# EAGLE schematic reveng-cpuonly-smdsock (EAGLE 6.4)
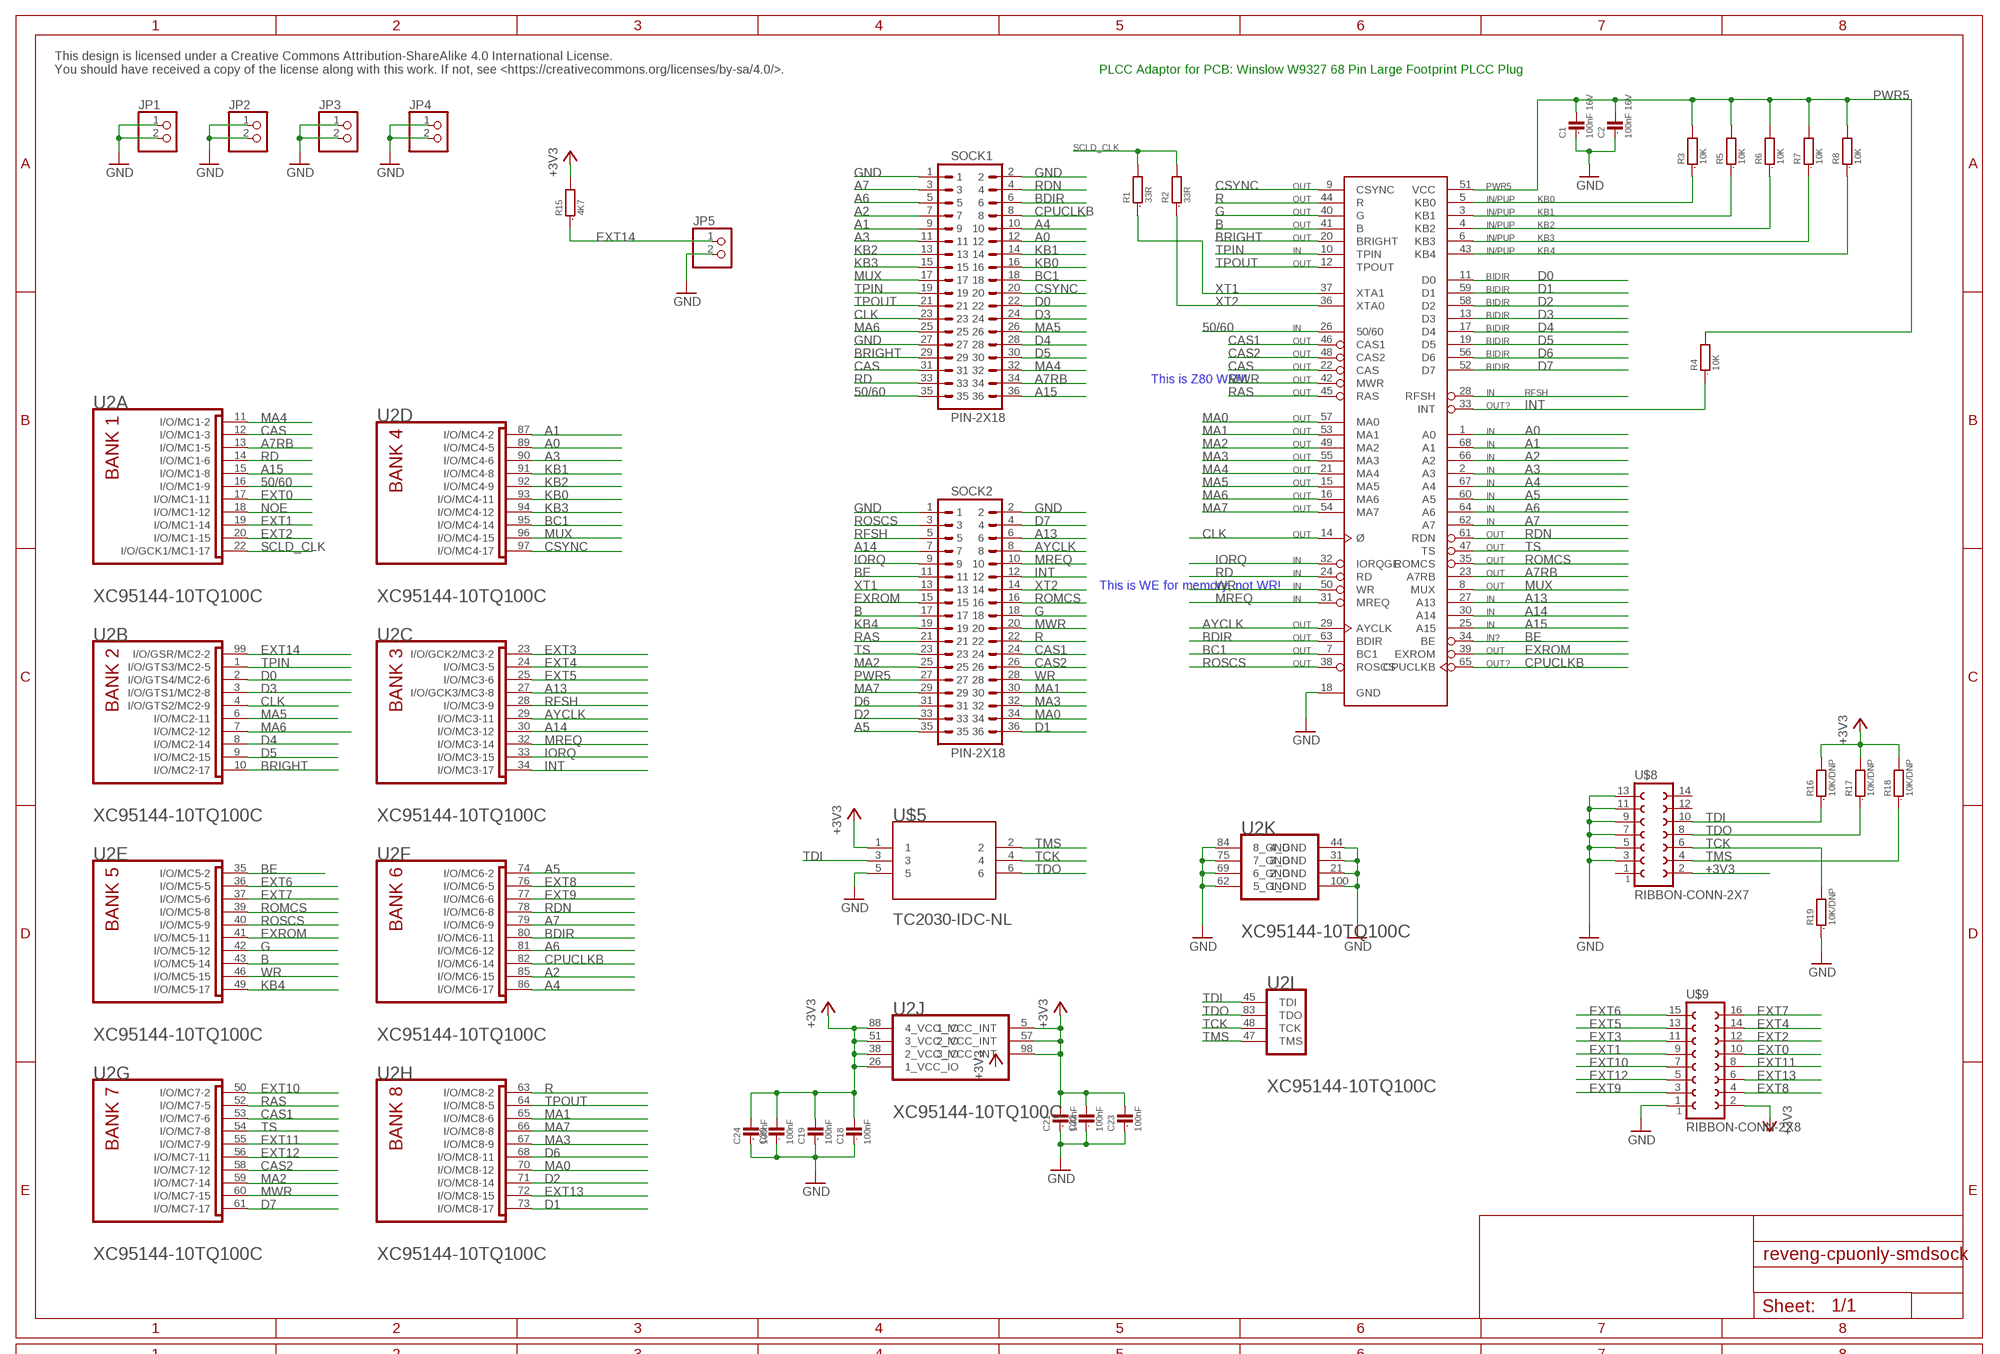
[diagram p0: schematic, sheet 1, part 1 of 2]
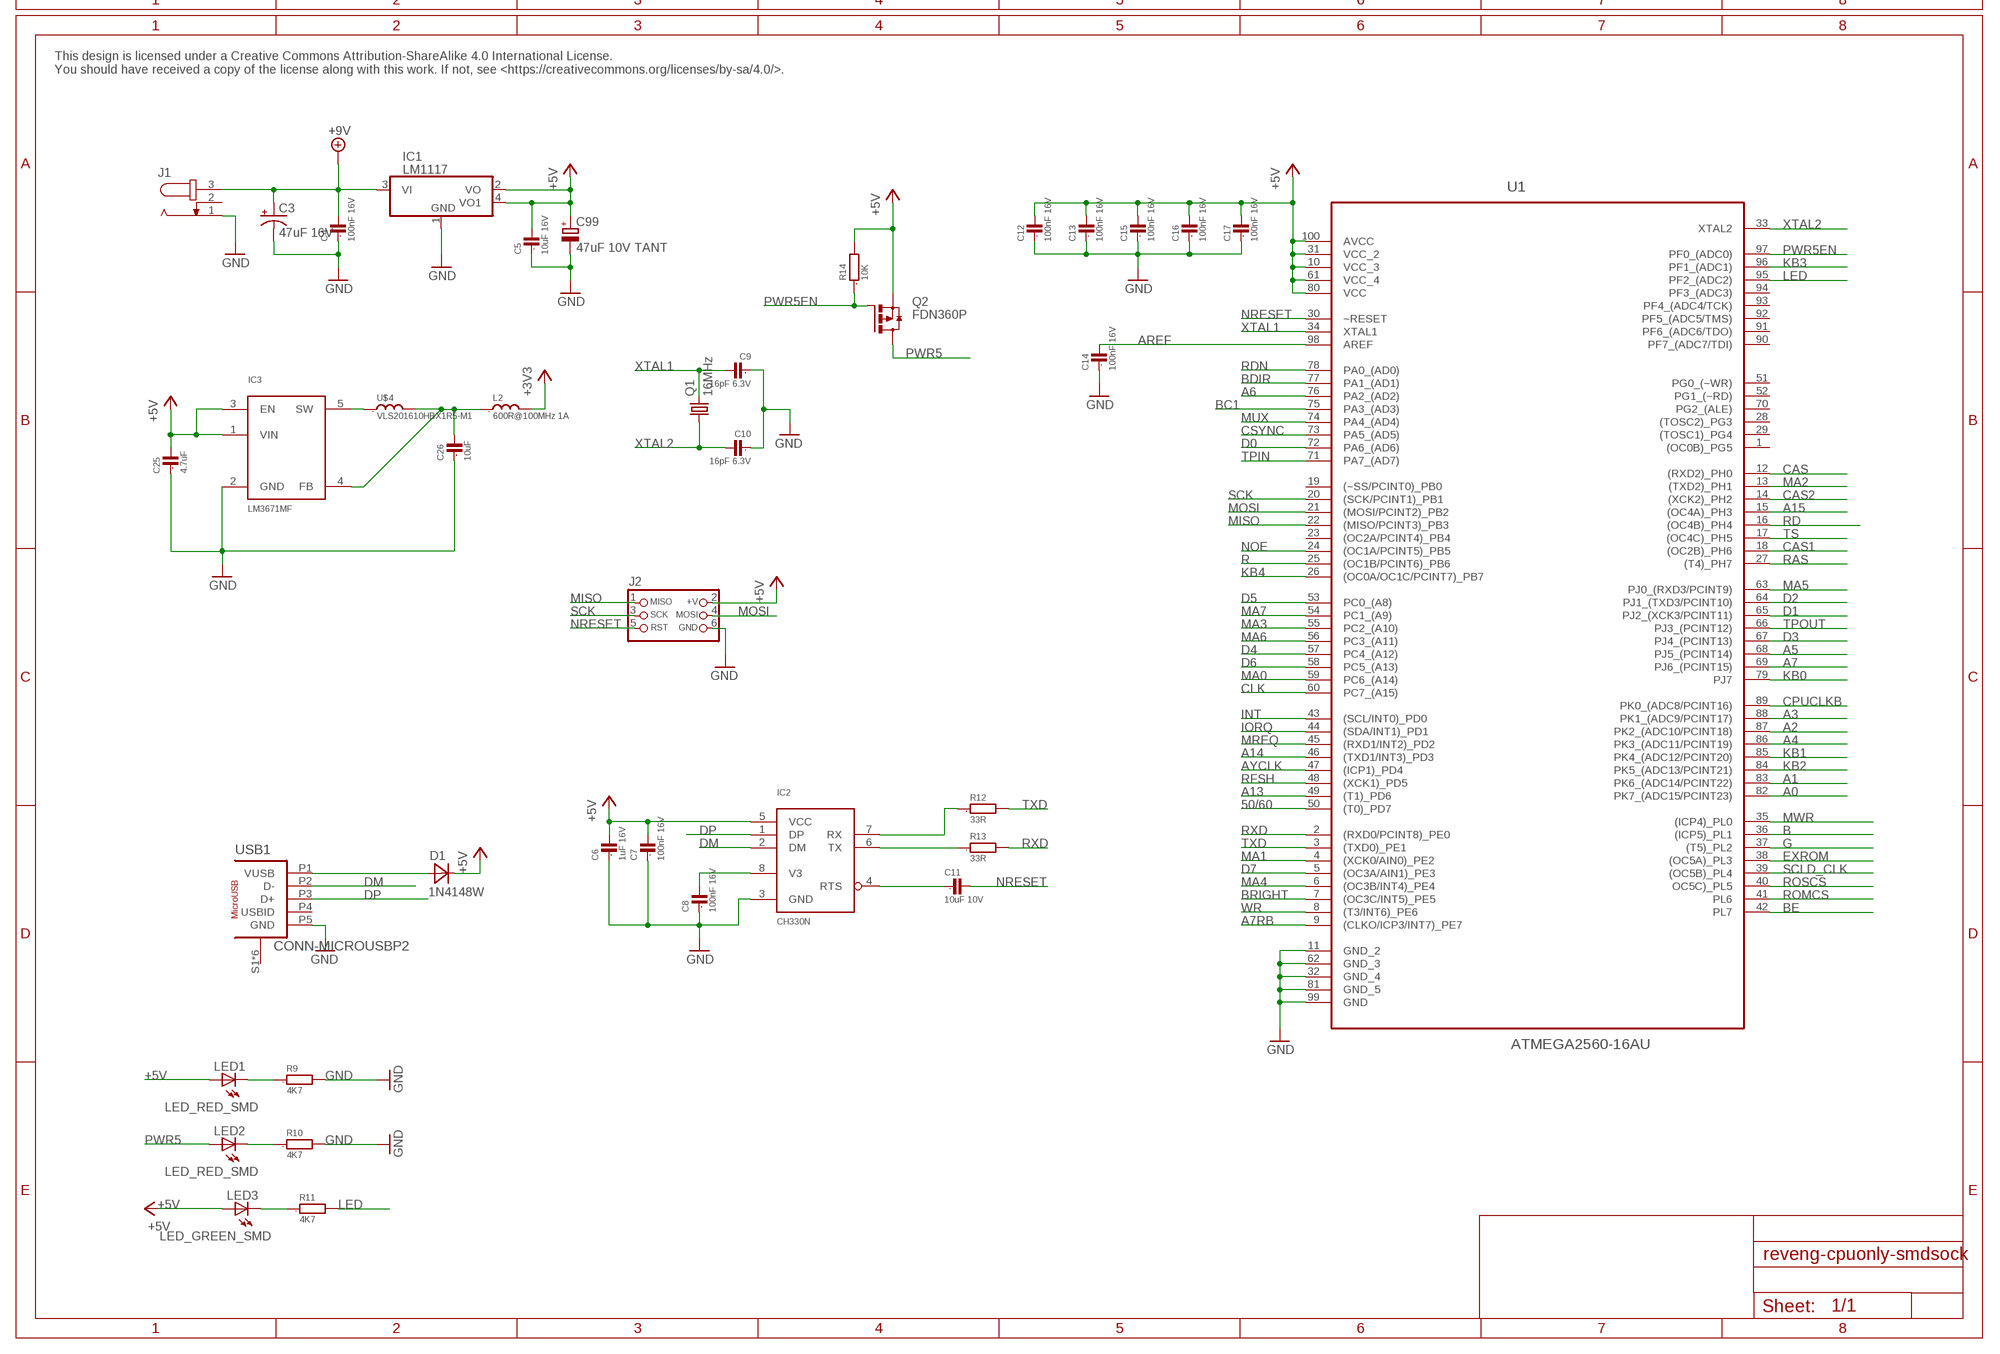
[diagram p1: schematic, sheet 1, part 2 of 2]

## Parts
C1  100nF 16V  C0603  [0603]
C2  100nF 16V  C0603  [0603]
C3  47uF 16V  CPOL-USE2.5-6  [E2,5-6]
C4  100nF 16V  C0603  [0603]
C5  10uF 16V  C0805  [0805]
C6  1uF 16V  C0603  [0603]
C7  100nF 16V  C0603  [0603]
C8  100nF 16V  C0603  [0603]
C9  16pF 6.3V  C0603  [0603]
C10  16pF 6.3V  C0603  [0603]
C11  10uF 10V  C0603  [0603]
C12  100nF 16V  C0603  [0603]
C13  100nF 16V  C0603  [0603]
C14  100nF 16V  C0603  [0603]
C15  100nF 16V  C0603  [0603]
C16  100nF 16V  C0603  [0603]
C17  100nF 16V  C0603  [0603]
C18  100nF  C0603  [0603]
C19  100nF  C0603  [0603]
C20  100nF  C0603  [0603]
C21  100nF  C0603  [0603]
C22  100nF  C0603  [0603]
C23  100nF  C0603  [0603]
C24  100nF  C0603  [0603]
C25  4.7uF  C0805  [0805]
C26  10uF  C0805  [0805]
C99  47uF 10V TANT  TANT_CASE_A  [TANT_CASE_A]
D1  1N4148W  [SOD-123]
IC1  LM1117  [SOT223]
IC2  CH330N  [SOIC8]
IC3  LM3671MF  [SOT23-5L]
J1  JACK-PLUG  [SPC4078-NOSLOT]
J2  CON_HEADER_PRG_AVR_ICSP-PTH  [HEADER_PRG_2X03]
JP1  PINHD-1X2  [1X02]
JP2  PINHD-1X2  [1X02]
JP3  PINHD-1X2  [1X02]
JP4  PINHD-1X2  [1X02]
JP5  PINHD-1X2  [1X02]
L2  600R@100MHz 1A  L0805  [0805]
LED1  LED_RED_SMD  LED-0603  [LED-603]
LED2  LED_RED_SMD  LED-0603  [LED-603]
LED3  LED_GREEN_SMD  LED-0603  [LED-603]
Q1  16MHz  CRYSTALHC49U-V  [HC49U-V]
Q2  FDN360P  [SUPER-SOT3]
R1  33R  R0603  [0603]
R2  33R  R0603  [0603]
R3  10K  R0603  [0603]
R4  10K  R0603  [0603]
R5  10K  R0603  [0603]
R6  10K  R0603  [0603]
R7  10K  R0603  [0603]
R8  10K  R0603  [0603]
R9  4K7  R0603  [0603]
R10  4K7  R0603  [0603]
R11  4K7  R0603  [0603]
R12  33R  R0603  [0603]
R13  33R  R0603  [0603]
R14  10K  R0603  [0603]
R15  4K7  R0603  [0603]
R16  10K/DNP  R0603  [0603]
R17  10K/DNP  R0603  [0603]
R18  10K/DNP  R0603  [0603]
R19  10K/DNP  R0603  [0603]
SCLD1  2048SCLDSMDSOCK  [PLCC68-AMP-SOCKET]
SOCK1  PIN-2X18  [PIN-2X18]
SOCK2  PIN-2X18  [PIN-2X18]
U1  ATMEGA2560-16AU  [QFP50P1600X1600X120-100N]
U2  XILINX_XC95144-10TQ100CLQFP  [LQFP100]
U$4  VLS201610HBX1R5-M1  [IND_0806]
U$5  TC2030-IDC-NL  [TC2030-IDC-NL]
U$8  RIBBON-CONN-2X7  [RIBBON-CONN-2X7]
U$9  RIBBON-CONN-2X8  [RIBBON-CONN-2X8]
USB1  CONN-MICROUSBP2  [MICROUSB_SMD_TH_7.5MM_4.85MM]

## Nets
50/60: SCLD1.26(50/60) SOCK1.35 U1.50((T0)_PD7) U2.16(A:I/O/MC1-9)
+3V3: C18.2 C19.2 C20.2 C21.2 C22.2 C23.2 C24.2 L2.2 R15.2 R16.2 R17.2 R18.2 U2.5(J:1_VCC_INT) U2.26(J:1_VCC_IO) U2.38(J:2_VCC_IO) U2.51(J:3_VCC_IO) U2.57(J:2_VCC_INT) U2.88(J:4_VCC_IO) U2.98(J:3_VCC_INT) U$5.1 U$8.2 U$9.2
+5V: C5.2 C6.2 C7.2 C12.2 C13.2 C15.2 C16.2 C17.2 C25.2 C99.PLUS(+) D1.1(C) IC1.2(VO) IC1.4(VO1) IC2.5(VCC) IC3.1(VIN) IC3.3(EN) J2.2(+V) LED1.A LED3.A Q2.2(S) R14.2 U1.10(VCC_3) U1.31(VCC_2) U1.61(VCC_4) U1.80(VCC) U1.100(AVCC)
+9V: C3.+ C4.2 IC1.3(VI) J1.3
A0: SCLD1.1(A0) SOCK1.12 U1.82(PK7_(ADC15/PCINT23)) U2.89(D:I/O/MC4-5)
A1: SCLD1.68(A1) SOCK1.9 U1.83(PK6_(ADC14/PCINT22)) U2.87(D:I/O/MC4-2)
A2: SCLD1.66(A2) SOCK1.7 U1.87(PK2_(ADC10/PCINT18)) U2.85(F:I/O/MC6-15)
A3: SCLD1.2(A3) SOCK1.11 U1.88(PK1_(ADC9/PCINT17)) U2.90(D:I/O/MC4-6)
A4: SCLD1.67(A4) SOCK1.10 U1.86(PK3_(ADC11/PCINT19)) U2.86(F:I/O/MC6-17)
A5: SCLD1.60(A5) SOCK2.35 U1.68(PJ5_(PCINT14)) U2.74(F:I/O/MC6-2)
A6: SCLD1.64(A6) SOCK1.5 U1.76(PA2_(AD2)) U2.81(F:I/O/MC6-12)
A7: SCLD1.62(A7) SOCK1.3 U1.69(PJ6_(PCINT15)) U2.79(F:I/O/MC6-9)
A7RB: SCLD1.23(A7RB) SOCK1.34 U1.9((CLKO/ICP3/INT7)_PE7) U2.13(A:I/O/MC1-5)
A13: SCLD1.27(A13) SOCK2.6 U1.49((T1)_PD6) U2.27(C:I/O/GCK3/MC3-8)
A14: SCLD1.30(A14) SOCK2.7 U1.46((TXD1/INT3)_PD3) U2.30(C:I/O/MC3-12)
A15: SCLD1.25(A15) SOCK1.36 U1.15((OC4A)_PH3) U2.15(A:I/O/MC1-8)
AREF: C14.2 U1.98(AREF)
AYCLK: SCLD1.29(AYCLK) SOCK2.8 U1.47((ICP1)_PD4) U2.29(C:I/O/MC3-11)
B: SCLD1.41(B) SOCK2.17 U1.36((ICP5)_PL1) U2.43(E:I/O/MC5-14)
BC1: SCLD1.7(BC1) SOCK1.18 U1.75(PA3_(AD3)) U2.95(D:I/O/MC4-14)
BDIR: SCLD1.63(BDIR) SOCK1.6 U1.77(PA1_(AD1)) U2.80(F:I/O/MC6-11)
BE: SCLD1.34(BE) SOCK2.11 U1.42(PL7) U2.35(E:I/O/MC5-2)
BRIGHT: SCLD1.20(BRIGHT) SOCK1.29 U1.7((OC3C/INT5)_PE5) U2.10(B:I/O/MC2-17)
CAS: SCLD1.22(CAS) SOCK1.31 U1.12((RXD2)_PH0) U2.12(A:I/O/MC1-3)
CAS1: SCLD1.46(CAS1) SOCK2.24 U1.18((OC2B)_PH6) U2.53(G:I/O/MC7-6)
CAS2: SCLD1.48(CAS2) SOCK2.26 U1.14((XCK2)_PH2) U2.58(G:I/O/MC7-12)
CLK: SCLD1.14(Ø) SOCK1.23 U1.60(PC7_(A15)) U2.4(B:I/O/GTS2/MC2-9)
CPUCLKB: SCLD1.65(CPUCLKB) SOCK1.8 U1.89(PK0_(ADC8/PCINT16)) U2.82(F:I/O/MC6-14)
CSYNC: SCLD1.9(CSYNC) SOCK1.20 U1.73(PA5_(AD5)) U2.97(D:I/O/MC4-17)
D0: SCLD1.11(D0) SOCK1.22 U1.72(PA6_(AD6)) U2.2(B:I/O/GTS4/MC2-6)
D1: SCLD1.59(D1) SOCK2.36 U1.65(PJ2_(XCK3/PCINT11)) U2.73(H:I/O/MC8-17)
D2: SCLD1.58(D2) SOCK2.33 U1.64(PJ1_(TXD3/PCINT10)) U2.71(H:I/O/MC8-14)
D3: SCLD1.13(D3) SOCK1.24 U1.67(PJ4_(PCINT13)) U2.3(B:I/O/GTS1/MC2-8)
D4: SCLD1.17(D4) SOCK1.28 U1.57(PC4_(A12)) U2.8(B:I/O/MC2-14)
D5: SCLD1.19(D5) SOCK1.30 U1.53(PC0_(A8)) U2.9(B:I/O/MC2-15)
D6: SCLD1.56(D6) SOCK2.31 U1.58(PC5_(A13)) U2.68(H:I/O/MC8-11)
D7: SCLD1.52(D7) SOCK2.4 U1.5((OC3A/AIN1)_PE3) U2.61(G:I/O/MC7-17)
DM: IC2.2(DM) USB1.P2(D-)
DP: IC2.1(DP) USB1.P3(D+)
EXROM: SCLD1.39(EXROM) SOCK2.15 U1.38((OC5A)_PL3) U2.41(E:I/O/MC5-11)
EXT0: U2.17(A:I/O/MC1-11) U$9.10
EXT1: U2.19(A:I/O/MC1-14) U$9.9
EXT2: U2.20(A:I/O/MC1-15) U$9.12
EXT3: U2.23(C:I/O/GCK2/MC3-2) U$9.11
EXT4: U2.24(C:I/O/MC3-5) U$9.14
EXT5: U2.25(C:I/O/MC3-6) U$9.13
EXT6: U2.36(E:I/O/MC5-5) U$9.15
EXT7: U2.37(E:I/O/MC5-6) U$9.16
EXT8: U2.76(F:I/O/MC6-5) U$9.4
EXT9: U2.77(F:I/O/MC6-6) U$9.3
EXT10: U2.50(G:I/O/MC7-2) U$9.7
EXT11: U2.55(G:I/O/MC7-9) U$9.8
EXT12: U2.56(G:I/O/MC7-11) U$9.5
EXT13: U2.72(H:I/O/MC8-15) U$9.6
EXT14: JP5.1 R15.1 U2.99(B:I/O/GSR/MC2-2)
G: SCLD1.40(G) SOCK2.18 U1.37((T5)_PL2) U2.42(E:I/O/MC5-12)
GND: C1.1 C2.1 C3.- C4.1 C5.1 C6.1 C7.1 C8.1 C9.1 C10.1 C12.1 C13.1 C14.1 C15.1 C16.1 C17.1 C18.1 C19.1 C20.1 C21.1 C22.1 C23.1 C24.1 C25.1 C26.1 C99.MINUS(-) IC1.1(GND) IC2.3(GND) IC3.2(GND) J1.1 J2.6(GND) JP1.1 JP1.2 JP2.1 JP2.2 JP3.1 JP3.2 JP4.1 JP4.2 JP5.2 R9.2 R10.2 R19.1 SCLD1.18(GND) SOCK1.1 SOCK1.2 SOCK1.27 SOCK2.1 SOCK2.2 U1.11(GND_2) U1.32(GND_4) U1.62(GND_3) U1.81(GND_5) U1.99(GND) U2.21(K:2_GND) U2.31(K:3_GND) U2.44(K:4_GND) U2.62(K:5_GND) U2.69(K:6_GND) U2.75(K:7_GND) U2.84(K:8_GND) U2.100(K:1_GND) U$5.5 U$8.3 U$8.5 U$8.7 U$8.9 U$8.11 U$8.13 U$9.1 USB1.P5(GND)
INT: R4.1 SCLD1.33(INT) SOCK2.12 U1.43((SCL/INT0)_PD0) U2.34(C:I/O/MC3-17)
IORQ: SCLD1.32(IORQGE) SOCK2.9 U1.44((SDA/INT1)_PD1) U2.33(C:I/O/MC3-15)
KB0: R3.1 SCLD1.5(KB0) SOCK1.16 U1.79(PJ7) U2.93(D:I/O/MC4-11)
KB1: R5.1 SCLD1.3(KB1) SOCK1.14 U1.85(PK4_(ADC12/PCINT20)) U2.91(D:I/O/MC4-8)
KB2: R6.1 SCLD1.4(KB2) SOCK1.13 U1.84(PK5_(ADC13/PCINT21)) U2.92(D:I/O/MC4-9)
KB3: R7.1 SCLD1.6(KB3) SOCK1.15 U1.96(PF1_(ADC1)) U2.94(D:I/O/MC4-12)
KB4: R8.1 SCLD1.43(KB4) SOCK2.19 U1.26((OC0A/OC1C/PCINT7)_PB7) U2.49(E:I/O/MC5-17)
LED: R11.2 U1.95(PF2_(ADC2))
MA0: SCLD1.57(MA0) SOCK2.34 U1.59(PC6_(A14)) U2.70(H:I/O/MC8-12)
MA1: SCLD1.53(MA1) SOCK2.30 U1.4((XCK0/AIN0)_PE2) U2.65(H:I/O/MC8-6)
MA2: SCLD1.49(MA2) SOCK2.25 U1.13((TXD2)_PH1) U2.59(G:I/O/MC7-14)
MA3: SCLD1.55(MA3) SOCK2.32 U1.55(PC2_(A10)) U2.67(H:I/O/MC8-9)
MA4: SCLD1.21(MA4) SOCK1.32 U1.6((OC3B/INT4)_PE4) U2.11(A:I/O/MC1-2)
MA5: SCLD1.15(MA5) SOCK1.26 U1.63(PJ0_(RXD3/PCINT9)) U2.6(B:I/O/MC2-11)
MA6: SCLD1.16(MA6) SOCK1.25 U1.56(PC3_(A11)) U2.7(B:I/O/MC2-12)
MA7: SCLD1.54(MA7) SOCK2.29 U1.54(PC1_(A9)) U2.66(H:I/O/MC8-8)
MISO: J2.1(MISO) U1.22((MISO/PCINT3)_PB3)
MOSI: J2.4(MOSI) U1.21((MOSI/PCINT2)_PB2)
MREQ: SCLD1.31(MREQ) SOCK2.10 U1.45((RXD1/INT2)_PD2) U2.32(C:I/O/MC3-14)
MUX: SCLD1.8(MUX) SOCK1.17 U1.74(PA4_(AD4)) U2.96(D:I/O/MC4-15)
MWR: SCLD1.42(MWR) SOCK2.20 U1.35((ICP4)_PL0) U2.60(G:I/O/MC7-15)
N$2: C8.2 IC2.8(V3)
N$4: D1.2(A) USB1.P1(VUSB)
N$5: IC2.7(RX) R12.1
N$6: IC2.6(TX) R13.1
N$7: C11.1 IC2.4(RTS)
N$20: LED2.C R10.1
N$22: LED3.C R11.1
N$58: LED1.C R9.1
NOE: U1.24((OC1A/PCINT5)_PB5) U2.18(A:I/O/MC1-12)
NRESET: C11.2 J2.5(RST) U1.30(~RESET)
PWR5: C1.2 C2.2 LED2.A Q2.3(D) R3.2 R4.2 R5.2 R6.2 R7.2 R8.2 SCLD1.51(VCC) SOCK2.27
PWR5EN: Q2.1(G) R14.1 U1.97(PF0_(ADC0))
R: SCLD1.44(R) SOCK2.22 U1.25((OC1B/PCINT6)_PB6) U2.63(H:I/O/MC8-2)
RAS: SCLD1.45(RAS) SOCK2.21 U1.27((T4)_PH7) U2.52(G:I/O/MC7-5)
RD: SCLD1.24(RD) SOCK1.33 U1.16((OC4B)_PH4) U2.14(A:I/O/MC1-6)
RDN: SCLD1.61(RDN) SOCK1.4 U1.78(PA0_(AD0)) U2.78(F:I/O/MC6-8)
RFSH: SCLD1.28(RFSH) SOCK2.5 U1.48((XCK1)_PD5) U2.28(C:I/O/MC3-9)
ROMCS: SCLD1.35(ROMCS) SOCK2.16 U1.41(PL6) U2.39(E:I/O/MC5-8)
ROSCS: SCLD1.38(ROSCS) SOCK2.3 U1.40(OC5C)_PL5) U2.40(E:I/O/MC5-9)
RXD: R13.2 U1.2((RXD0/PCINT8)_PE0)
SCK: J2.3(SCK) U1.20((SCK/PCINT1)_PB1)
SCLD_CLK: R1.2 R2.2 U1.39((OC5B)_PL4) U2.22(A:I/O/GCK1/MC1-17)
SW: IC3.5(SW) U$4.P$1
TCK: R19.2 U2.48(I:TCK) U$5.4 U$8.6
TDI: R16.1 U2.45(I:TDI) U$5.3 U$8.10
TDO: R17.1 U2.83(I:TDO) U$5.6 U$8.8
TMS: R18.1 U2.47(I:TMS) U$5.2 U$8.4
TPIN: SCLD1.10(TPIN) SOCK1.19 U1.71(PA7_(AD7)) U2.1(B:I/O/GTS3/MC2-5)
TPOUT: SCLD1.12(TPOUT) SOCK1.21 U1.66(PJ3_(PCINT12)) U2.64(H:I/O/MC8-5)
TS: SCLD1.47(TS) SOCK2.23 U1.17((OC4C)_PH5) U2.54(G:I/O/MC7-8)
TXD: R12.2 U1.3((TXD0)_PE1)
V33: C26.2 IC3.4(FB) L2.1 U$4.P$2
WR: SCLD1.50(WR) SOCK2.28 U1.8((T3/INT6)_PE6) U2.46(E:I/O/MC5-15)
XT1: R1.1 SCLD1.37(XTA1) SOCK2.13
XT2: R2.1 SCLD1.36(XTA0) SOCK2.14
XTAL1: C9.2 Q1.2 U1.34(XTAL1)
XTAL2: C10.2 Q1.1 U1.33(XTAL2)
Unconnected: J1.2 U1.1((OC0B)_PG5) U1.19((~SS/PCINT0)_PB0) U1.23((OC2A/PCINT4)_PB4) U1.28((TOSC2)_PG3) U1.29((TOSC1)_PG4) U1.51(PG0_(~WR)) U1.52(PG1_(~RD)) U1.70(PG2_(ALE)) U1.90(PF7_(ADC7/TDI)) U1.91(PF6_(ADC6/TDO)) U1.92(PF5_(ADC5/TMS)) U1.93(PF4_(ADC4/TCK)) U1.94(PF3_(ADC3)) U$8.1 U$8.12 U$8.14 USB1.P4(USBID) USB1.S1(SHIELD) USB1.S2(SHIELD) USB1.S3(SHIELD) USB1.S4(SHIELD) USB1.S5(SHIELD) USB1.S6(SHIELD)

## Notes on the sheet
- This design is licensed under a Creative Commons Attribution-ShareAlike 4.0 International License.
  You should have received a copy of the license along with this work. If not, see <https://creativecommons.org/licenses/by-sa/4.0/>.
- PLCC Adaptor for PCB: Winslow W9327 68 Pin Large Footprint PLCC Plug
- OUT
- OUT | IN/PUP
- OUT | IN/PUP
- OUT | IN/PUP
- OUT | IN/PUP
- IN | IN/PUP
- OUT
- BIDIR
- BIDIR
- BIDIR
- BIDIR
- IN | BIDIR
- OUT | BIDIR
- OUT | BIDIR
- OUT | BIDIR
- This is Z80 WR!!! | OUT
- OUT | IN
- OUT?
- OUT
- OUT | IN
- OUT | IN
- OUT | IN
- OUT | IN
- OUT | IN
- OUT | IN
- OUT | IN
- IN
- OUT | OUT
- OUT
- IN | OUT
- IN | OUT
- This is WE for memory, not WR! | IN | OUT
- IN | IN
- IN
- OUT | IN
- OUT | IN?
- OUT | OUT
- OUT | OUT?
- This design is licensed under a Creative Commons Attribution-ShareAlike 4.0 International License.
  You should have received a copy of the license along with this work. If not, see <https://creativecommons.org/licenses/by-sa/4.0/>.

## Library data of the parts
C1 C2 C4-C26 = GadgetFactory:C: CAPACITOR, European symbol
C3 = rcl:CPOL-US: POLARIZED CAPACITOR, American symbol
C99 = alvie:TANT_CASE_A
D1 = alvie:1N4148W
IC1 = alvie:LM1117
IC2 = alvie:CH330N
IC3 = alvie:LM3671
J1 = GadgetFactory:JACK-PLUG: DC POWER JACK Power Jack, DC, Right Angle, Through Hole, Rated 5A at 16VDC, PC Terminals Distributor: Farnell (www.Farnell.de) Drawing: 84N1161.pdf / 84N1162.pdf Manufacturer: SPC Technology (www.spctechnology.com) Type: SPC4077 / SPC 4078
J2 = dp_devices:CON_HEADER_PRG_AVR_ICSP: 2x3 AVR ICSP programming header
JP1-JP5 = GadgetFactory:PINHD-1X2: PIN HEADER
L2 = GadgetFactory:L: INDUCTOR, European symbol
LED1-LED3 = dp_devices:LED: Light Emitting Diode
Q1 = crystal:CRYSTAL: CRYSTAL; OC_FARNELL: 1666969; OC_NEWARK: unknown
Q2 = transistor-power:FDN360P: Single P-Channel, PowerTrench (R) MOSFET Source: http://www.fairchildsemi.com/ds/FD/FDN360P.pdf
R1-R19 = GadgetFactory:R: RESISTOR, European symbol
SCLD1 = alvie:2048SCLD
SOCK1 SOCK2 = alvie:PIN-2X18
U1 = Atmel_By_element14_Batch_1-00:ATMEGA2560-16AU: Microcontroller; DESCRIPTION: Microcontroller; MPN: ATMEGA2560-16AU; OC_FARNELL: 1288330; OC_NEWARK: 23M5051; PACKAGE: LQFP-100; SUPPLIER: ATMEL
U2 = Xilinx - XC95144-10TQ100C:XILINX_XC95144-10TQ100C: PLD-XC9K-XC95144-SQ100A
U$4 = alvie:VLS201610HBX
U$5 = alvie:TC2030-IDC-NL
U$8 = alvie:RIBBON-CONN-2X7
U$9 = alvie:RIBBON-CONN-2X8
USB1 = alvie:CONN-MICROUSB